# Altium schematic sheet bno08x_module.SchDoc
size A4; SheetNumber: 1; SheetTotal: 1
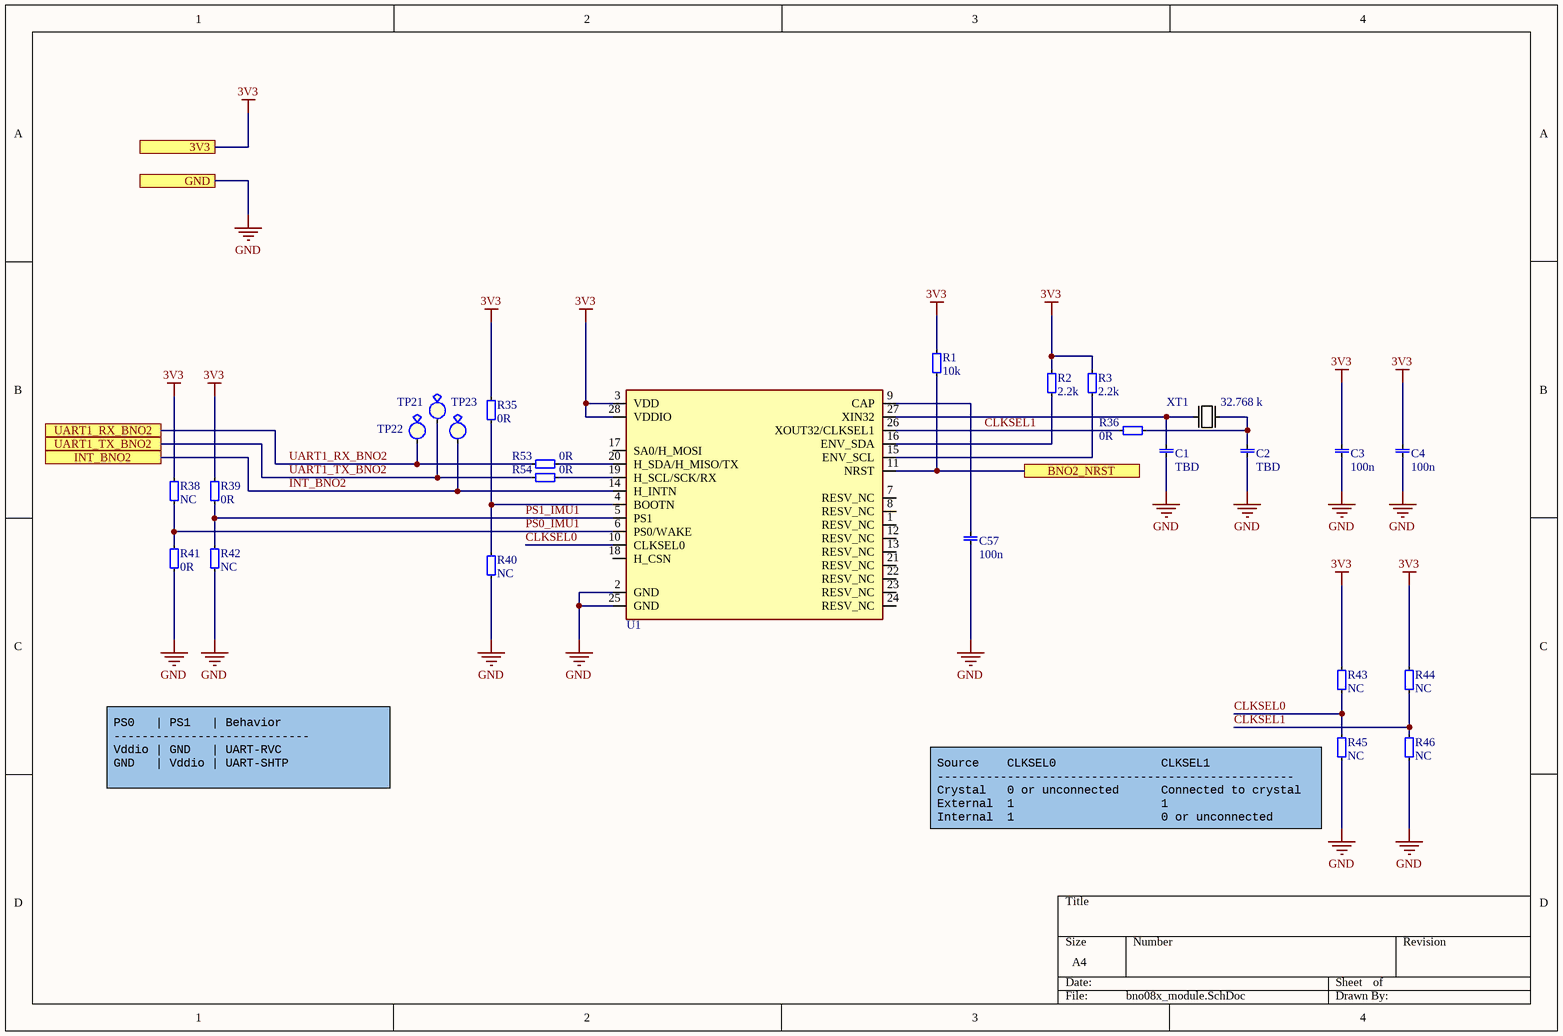
[diagram p0: bno08x_module.SchDoc]

## Parts
C1  value TBD  [0402 CAP]  (hidden comment: 0402 capacitor)
C2  value TBD  [0402 CAP]  (hidden comment: 0402 capacitor)
C3  value 100n  [0402 CAP]  (hidden comment: 0402 capacitor)
C4  value 100n  [0402 CAP]  (hidden comment: 0402 capacitor)
C57  value 100n  [0402 CAP]  (hidden comment: 0402 capacitor)
R1  value 10k  [0402 res]  (hidden comment: 0402, resistor)
R2  value 2.2k  [0402 res]  (hidden comment: 0402, resistor)
R3  value 2.2k  [0402 res]  (hidden comment: 0402, resistor)
R35  value 0R  [0402 res]  (hidden comment: 0402, resistor)
R36  value 0R  [0402 res]  (hidden comment: 0402, resistor)
R38  value NC  [0402 res]  (hidden comment: 0402, resistor)
R39  value 0R  [0402 res]  (hidden comment: 0402, resistor)
R40  value NC  [0402 res]  (hidden comment: 0402, resistor)
R41  value 0R  [0402 res]  (hidden comment: 0402, resistor)
R42  value NC  [0402 res]  (hidden comment: 0402, resistor)
R43  value NC  [0402 res]  (hidden comment: 0402, resistor)
R44  value NC  [0402 res]  (hidden comment: 0402, resistor)
R45  value NC  [0402 res]  (hidden comment: 0402, resistor)
R46  value NC  [0402 res]  (hidden comment: 0402, resistor)
R53  value 0R  [0402 res]  (hidden comment: 0402, resistor)
R54  value 0R  [0402 res]  (hidden comment: 0402, resistor)
TP21  Test Point  [TESTPOINT_SMD]  (value not drawn)
TP22  Test Point  [TESTPOINT_SMD]  (value not drawn)
TP23  Test Point  [TESTPOINT_SMD]  (value not drawn)
U1  BNO08X  [LGA-28_2]  (value not drawn)
XT1  value 32.768 k  [ECS-.327-12.5-39-TR]  (hidden comment: Crystal)

## Ports
3V3, BNO2_NRST, GND, INT_BNO2, UART1_RX_BNO2, UART1_TX_BNO2

## Nets
3V3: C3.1 C4.1 R1.1 R2.1 R3.1 R35.1 R38.0 R39.0 R43.0 R44.0 U1.3(VDD) U1.28(VDDIO) ; port 3V3
GND: C1.0 C2.0 C3.0 C4.0 C57.0 R40.1 R41.1 R42.1 R45.1 R46.1 U1.2(GND) U1.25(GND) ; port GND
BNO2_NRST: R1.0 U1.11(NRST) ; port BNO2_NRST
CLKSEL0: R43.1 R45.0 U1.10(CLKSEL0)
CLKSEL1: R36.0 R44.1 R46.0 U1.26(XOUT32/CLKSEL1)
INT_BNO2: TP23.0 U1.14(H_INTN) ; port INT_BNO2
PS0_IMU1: R38.1 R41.0 U1.6(PS0/WAKE)
PS1_IMU1: R39.1 R42.0 U1.5(PS1)
UART1_RX_BNO2: R53.1 TP22.0 ; port UART1_RX_BNO2
UART1_TX_BNO2: R54.1 TP21.0 ; port UART1_TX_BNO2
NetC1_1: C1.1 U1.27(XIN32) XT1.1
NetC2_1: C2.1 R36.1 XT1.2
NetC57_1: C57.1 U1.9(CAP)
NetR2_0: R2.0 U1.16(ENV_SDA)
NetR3_0: R3.0 U1.15(ENV_SCL)
NetR35_0: R35.0 R40.0 U1.4(BOOTN)
NetR53_0: R53.0 U1.20(H_SDA/H_MISO/TX)
NetR54_0: R54.0 U1.19(H_SCL/SCK/RX)

Not connected (* = marked no-connect by the designer): U1 1(RESV_NC) 7(RESV_NC) 8(RESV_NC) 12(RESV_NC) 13(RESV_NC) 17(SA0/H_MOSI) 18(H_CSN) 21(RESV_NC) 22(RESV_NC) 23(RESV_NC) 24(RESV_NC)

## Notes on the sheet
- PS0   | PS1   | Behavior
  ----------------------------
  Vddio | GND   | UART-RVC
  GND   | Vddio | UART-SHTP
- (near R45) Source    CLKSEL0               CLKSEL1
  ---------------------------------------------------
  Crystal   0 or unconnected      Connected to crystal
  External  1                     1
  Internal  1                     0 or unconnected

## Library data of the parts
C3 C4 C57 = 0402 capacitor: Manufacturer Part No: GRM155R62A104KE14D
R1 = 0402, resistor: Manufacturer Part No: 311-10.0KLRCT-ND
R2 R3 = 0402, resistor: Manufacturer Part No: RC0402FR-072K2L
R35 R36 R39 R41 R53 R54 = 0402, resistor: Manufacturer Part No: RMCF0402ZT0R00
U1 = BNO08X: 9-axis IMU; Manufacturer Part No: BNO085
XT1 = Crystal: Manufacturer Part No: CC4V-T1A-32.768KHZ-9PF-20PPM-TA-QC
TP21-TP23 = Test Point: Value: Test point; Farnell: 1702006